# EAGLE board Banshee (EAGLE 9.6.2)
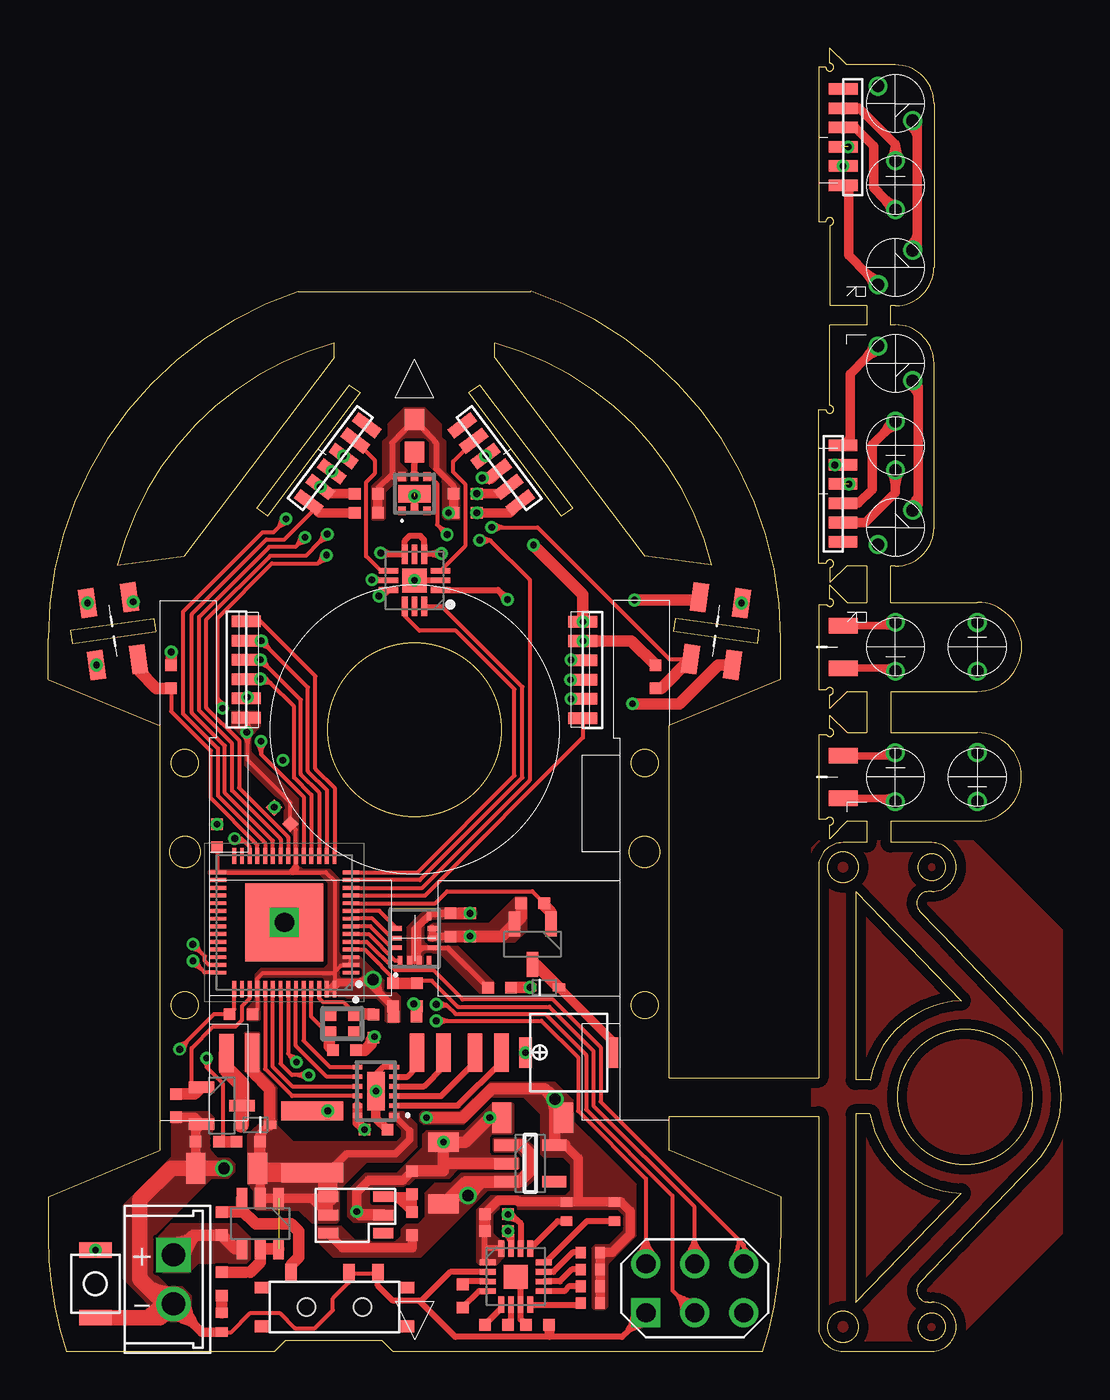
[diagram p2: board, top side]
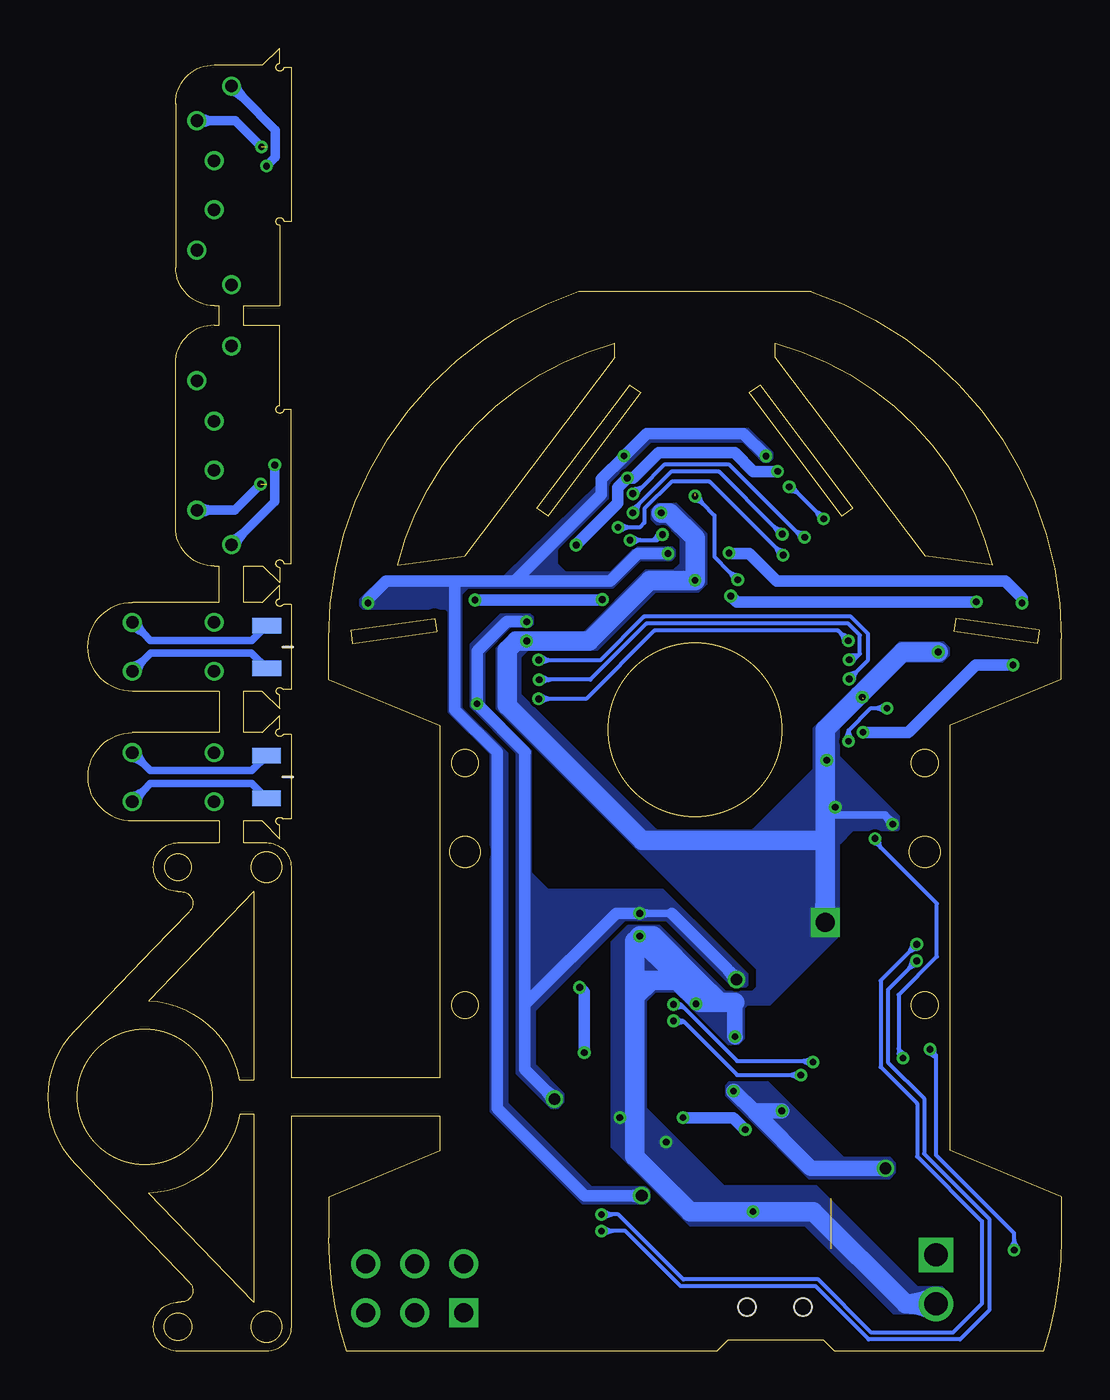
[diagram p3: board, bottom side, seen from below]

Size 52.55 x 67.62 mm. Coordinates in mm from the lower left corner, seen from the top.
Outline: 0.94,0 11.75,0 12.31,0.56 17.31,0.56 17.88,0 37.06,0 arc18 38,5.89
Outline: 0,36.98 0,34.85 5.79,32.46 5.79,10.44 0,8.03 0,5.89 arc18 0.94,0
Outline: 38,5.89 38,8.03 32.21,10.44 32.21,12.19 39.95,12.19 39.95,1.27 arc90 41.22,0 45.82,0 arc180 45.82,2.54 45.64,2.54
Outline: 25.02,54.99 12.98,54.99 arc71 0,36.98
Outline: 25.02,55 arc-72 38,36.98 38,34.85 32.21,32.46 32.21,14.2 39.95,14.2 39.95,25.12 arc-90 41.22,26.39 42.44,26.39 42.44,27.51 41.45,27.51 40.54,26.59 40.54,27.31 arc240 40.36,27.61
Outline: 23.17,52.31 arc-61 34.42,40.79 30.94,41.28 23.17,51.56 23.17,52.3
Outline: 51.16,9.73 47.09,5.54 45.21,3.56 arc133 45.64,2.56
Outline: 51.16,16.66 47.09,20.88 45.21,22.84
Outline: 42.62,14.07 41.89,14.07 41.89,23.85 47.35,18.19 arc78 42.63,14.07
Outline: 51.16,9.73 arc88 51.16,16.66
Outline: 47.35,8.2 41.89,2.54 41.89,12.32 42.62,12.32 arc78 47.35,8.2
Outline: 51.16,9.73 arc88 51.16,16.66
Outline: 45.22,22.84 arc-134 45.64,23.85 45.82,23.85 arc180 45.82,26.39 43.69,26.39 43.69,27.51 48.18,27.51 arc180 48.18,32.11 43.69,32.11 43.69,34.24 48.18,34.24 arc180 48.18,38.86 43.69,38.86 43.69,40.74 43.94,40.74 arc90 45.95,42.75 45.95,51.26 arc90 43.94,53.26
Outline: 40.54,39.04 40.54,39.05
Outline: 40.54,39.05 40.54,39.75 41.45,38.86 42.44,38.86 42.44,40.74 41.43,40.74 40.54,39.88 40.54,40.67 arc270 40.34,40.87 39.95,40.87 39.95,48.87 40.34,48.87 arc270 40.54,49.07 40.54,53.24 42.44,53.24 42.44,54.25 40.54,54.25 40.54,58.42 arc270 40.34,58.62 39.95,58.62 39.95,66.62 40.34,66.62 arc270 40.54,66.83 40.54,67.62 41.43,66.75 43.94,66.75 arc-90 45.95,64.75 45.95,56.24
Outline: 43.94,53.24 43.69,53.24 43.69,54.25 43.94,54.25 arc90 45.94,56.24
Outline: 3.59,40.79 arc-61 14.83,52.3 14.83,51.56 7.06,41.28 3.58,40.79
Outline: 40.54,39.05 arc-243 40.36,38.76 39.95,38.76 39.95,34.34 40.36,34.34
Outline: 40.37,34.34 arc-243 40.54,34.06 40.54,33.35 41.45,34.24 42.44,34.24 42.44,32.11 41.45,32.11 40.54,33 40.54,32.31
Outline: 40.54,32.31 40.54,32.31
Outline: 40.54,32.31 arc-240 40.36,32 39.95,32 39.95,27.61 40.36,27.61
Outline: 36.86,37.41 32.51,38.02 32.41,37.34 36.78,36.73 36.86,37.41
Outline: 1.14,37.41 5.49,38.02 5.59,37.34 1.25,36.73 1.14,37.41
Outline: 26.62,43.33 21.82,49.73 22.38,50.14 27.2,43.76 26.62,43.33
Outline: 11.38,43.33 16.18,49.73 15.62,50.14 10.82,43.76 11.38,43.33
Outline: circle at 7.09,17.96 radius 0.7
Outline: circle at 7.09,25.91 radius 0.8
Outline: circle at 7.09,30.53 radius 0.7
Outline: circle at 19,32.26 radius 4.5
Outline: circle at 30.94,17.96 radius 0.7
Outline: circle at 30.94,25.91 radius 0.8
Outline: circle at 30.94,30.53 radius 0.7
Outline: circle at 41.23,25.12 radius 0.8
Outline: circle at 41.23,1.27 radius 0.8
Outline: circle at 47.55,13.21 radius 3.5
Outline: circle at 45.82,1.27 radius 0.71
Outline: circle at 45.82,25.12 radius 0.7
Copper layers (1*16): Top 0.035mm / dielectric 1.6mm / Bottom 0.035mm
Design rules "Elecrow_2-layer_PCB_eagle_rule *": minimum track width 6mil, minimum drill 12mil, track to track 6mil, track to pad 6mil, pad to pad 6mil, via to via 8mil, smd to smd 0mil, copper to edge 20mil, drill to drill 10mil, minimum pad ring 6mil, minimum via ring 6mil, stop-mask expansion 0mil, vias tented up to drill 100mil, thermal gap 0mil

## Footprints (pad centres in the part's own frame; a part is rotated, then mirrored left to right if it is on the bottom)
C3216 = smd 1 x 1.6: 1 -1.6,0; 2 1.6,0
R1005 = smd 0.6 x 0.6: P$1 -0.6,0; P$2 0.6,0
HRCON-2 = drill 1.2 pad 1.778 square: 1 0,0 | drill 1.2 pad 1.778: 2 0,-2.54
SODFL1608X70N = smd 0.64 x 0.42: 1 -0.75,0; 2 0.75,0
QFN40P700X700X90-57N = smd 0.85 x 0.2: 1 -3.45,2.6; 2 -3.45,2.2; 3 -3.45,1.8; 4 -3.45,1.4; 5 -3.45,1; 6 -3.45,0.6; 7 -3.45,0.2; 8 -3.45,-0.2; 9 -3.45,-0.6; 10 -3.45,-1; 11 -3.45,-1.4; 12 -3.45,-1.8; 13 -3.45,-2.2; 14 -3.45,-2.6; 29 3.45,-2.6; 30 3.45,-2.2; 31 3.45,-1.8; 32 3.45,-1.4; 33 3.45,-1; 34 3.45,-0.6; 35 3.45,-0.2; 36 3.45,0.2; 37 3.45,0.6; 38 3.45,1; 39 3.45,1.4; 40 3.45,1.8; 41 3.45,2.2; 42 3.45,2.6 | smd 0.2 x 0.85: 15 -2.6,-3.45; 16 -2.2,-3.45; 17 -1.8,-3.45; 18 -1.4,-3.45; 19 -1,-3.45; 20 -0.6,-3.45; 21 -0.2,-3.45; 22 0.2,-3.45; 23 0.6,-3.45; 24 1,-3.45; 25 1.4,-3.45; 26 1.8,-3.45; 27 2.2,-3.45; 28 2.6,-3.45; 43 2.6,3.45; 44 2.2,3.45; 45 1.8,3.45; 46 1.4,3.45; 47 1,3.45; 48 0.6,3.45; 49 0.2,3.45; 50 -0.2,3.45; 51 -0.6,3.45; 52 -1,3.45; 53 -1.4,3.45; 54 -1.8,3.45; 55 -2.2,3.45; 56 -2.6,3.45 | smd 4.05 x 4.05: 57 0,0
QFN50P300X300X80-17N = smd 0.85 x 0.3: 1 -1.45,0.75; 2 -1.45,0.25; 3 -1.45,-0.25; 4 -1.45,-0.75; 9 1.45,-0.75; 10 1.45,-0.25; 11 1.45,0.25; 12 1.45,0.75 | smd 0.3 x 0.85: 5 -0.75,-1.45; 6 -0.25,-1.45; 7 0.25,-1.45; 8 0.75,-1.45; 13 0.75,1.45; 14 0.25,1.45; 15 -0.25,1.45; 16 -0.75,1.45 | smd 1.25 x 1.25: 17 0,0
LGA-14(2.5X3X0.86) = smd 0.475 x 0.25: 1 -1.163,0.75; 2 -1.163,0.25; 3 -1.163,-0.25; 4 -1.163,-0.75; 8 1.163,-0.75 | smd 0.25 x 0.475: 5 -0.5,-0.912; 6 0,-0.912; 7 0.5,-0.912; 12 0.5,0.912; 13 0,0.912; 14 -0.5,0.912
SOT95P275X110-5N = smd 1.25 x 0.6: 1 -1.25,0.95; 2 -1.25,0; 3 -1.25,-0.95; 4 1.25,-0.95; 5 1.25,0.95
QFN50P300X300X100-13N = smd 1 x 0.3: 1 -1.35,0.5; 2 -1.35,0; 3 -1.35,-0.5; 7 1.35,-0.5; 8 1.35,0; 9 1.35,0.5 | smd 0.3 x 1: 4 -0.5,-1.35; 5 0,-1.35; 6 0.5,-1.35; 10 0.5,1.35; 11 0,1.35; 12 -0.5,1.35 | smd 1.25 x 1.25: 13 0,0
BCR421UFD7 = smd 0.37 x 0.45: 1 -0.65,-0.886; 3 0.65,-0.886; 4 0.65,0.886; 5 0,0.886; 6 -0.65,0.886 | smd 0.37 x 0.6: 2 0,-0.75 | smd 1.67 x 0.9: 7 0,0
DRV8835DSSR = smd 0.5 x 0.25: 1 -0.95,1.25; 2 -0.95,0.75; 3 -0.95,0.25; 4 -0.95,-0.25; 5 -0.95,-0.75; 6 -0.95,-1.25; 7 0.95,-1.25; 8 0.95,-0.75; 9 0.95,-0.25; 10 0.95,0.25; 11 0.95,0.75; 12 0.95,1.25 | smd 0.9 x 2: 13 0,0
LTR4206E = drill 0.65 pad 0.9: 1 -1.27,0; 2 1.27,0
SOT95P284X110-6N = smd 1.1 x 0.55: 1 -1.3,0.95; 2 -1.3,0; 3 -1.3,-0.95; 4 1.3,-0.95; 5 1.3,0; 6 1.3,0.95
SOT95P237X112-3N = smd 1.3 x 0.6: 1 -1.05,0.95; 2 -1.05,-0.95; 3 1.05,0
R1005' = smd 0.6 x 0.6: P$1 -0.602,0; P$2 0.602,0
R1608 = smd 1.1 x 1: 1 -0.85,0; 2 0.85,0
SENSOR_FRONT_PAD2 = smd 0.8 x 1.5: P$1 -1.1,0.85; P$2 1.1,0.85
LED_1005 = smd 0.5 x 0.6: P$1 -0.5,0; P$2 0.5,0
MUN12AD01-SG = smd 1.05 x 0.55: P$1 0,0; P$2 0,-0.95; P$3 0,-1.9; P$4 2.85,-1.9; P$5 2.85,-0.95; P$6 2.85,0
SFH_4550 = drill 0.65: ANODE -1.27,0; CASODE 1.27,0
PIN2_3 = drill 1 square: P$1 0,0 | drill 1: P$2 2.54,0; P$3 5.08,0; P$4 0,2.54; P$5 2.54,2.54; P$6 5.08,2.54
ENCORDER_R = smd 0.6 x 1.5: P$1 -2.5,-1; P$2 -1.5,-1; P$3 -0.5,-1; P$4 0.5,-1; P$5 1.5,-1; P$6 2.5,-1
BUZZER = smd 0.635 x 1.6: + 4.25,2; - -0.25,2
PAD = smd 0.75 x 2: P$1 0,0
TVAF06 = smd 1.7 x 0.8: P$1 1.45,3.25; P$2 1.45,-0.25
SWITCH = smd 0.75 x 0.6: P$1 -0.4,0.3; P$2 -0.4,2.3; P$3 7.1,0.3; P$4 7.1,2.3 | smd 0.6 x 1: P$5 5.6,3.05; P$6 4.1,3.05; P$7 1.1,3.05 | hole 0.9: 1.9,1.3; 4.8,1.3
XRCGB32_F = smd 0.75 x 0.7: 1 -0.675,-0.5; 2 0.675,-0.5; 3 0.675,0.5; 4 -0.675,0.5

## Placement (x,y rotation side)
C1  [C3216]  25.13,12.13 0 top
C2  0.1u  [R1005]  20.88,22.13 270 top
C3  0.1u  [R1005]  18.5,17.38 0 top
C4  12pF  [R1005]  16.88,16.88 270 top
C5  0.1u  [R1005]  19.13,18.5 90 top
C6  12pF  [R1005]  15.38,15.63 0 top
C7  1u  [R1005]  21.5,2.88 270 top
C8  10uF  [C3216]  9.25,9.5 180 top
C9  100pF  [R1005]  18.88,6.63 90 top
C10  22uF  [C3216]  20.5,9.25 270 top
C11  1u  [R1005]  23.25,1.38 0 top
C12  100nF  [R1005]  21.88,22.13 270 top
C13  [C3216]  14.5,10.88 270 top
C14  22uF  [C3216]  12.88,10.88 90 top
C15  0.1u  [R1005]  17,11.5 0 top
C16  1u  [R1005]  25.38,1.38 0 top
C17  0.1u  [R1005]  12.14,27.79 315 top
C21  100nF  [R1005]  8.75,26.75 90 top
CN2  [HRCON-2]  6.5,5 0 top
D1  RB520S30T5G  [SODFL1608X70N]  25.74,18.88 0 top
D2  RB520S30T5G  [SODFL1608X70N]  10.75,11.75 180 top
IC1  ESP32-S3-WROOM-1-N8  [QFN40P700X700X90-57N]  12.25,22.25 180 top
IC2  MAX8647ETE+  [QFN50P300X300X80-17N]  24.25,3.88 0 top
IC3  LSM6DS3USTR  [LGA-14(2.5X3X0.86)]  19,21.44 90 top
IC5  NCV8163ASN330T1G  [SOT95P275X110-5N]  25,9.75 0 top
IC6  DG2034EDN-T1-GE4  [QFN50P300X300X100-13N]  19,40 180 top
IC7  BCR421UFD-7  [BCR421UFD7]  19,44.5 0 top
IC8  DRV8835DSSR  [DRV8835DSSR]  17,13.5 180 top
Q1  LTR-4206E  [LTR4206E]  43.94,29.79 90 top
Q2  SI3493DDV-T1-GE3  [SOT95P284X110-6N]  11,6.63 270 top
Q3  IRFML8244TRPBF  [SOT95P237X112-3N]  25.13,21.13 270 top
Q4  LTR-4206E  [LTR4206E]  43.94,64.75 225 bottom
Q5  LTR-4206E  [LTR4206E]  43.94,56.24 45 top
Q6  LTR-4206E  [LTR4206E]  43.94,51.26 315 top
Q7  LTR-4206E  [LTR4206E]  43.94,36.56 270 top
Q8  LTR-4206E  [LTR4206E]  43.94,42.75 45 top
Q10  IRFML8244TRPBF  [SOT95P237X112-3N]  9,12.75 0 top
R1  10k  [R1005']  17.88,18.5 90 top
R2  3k  [R1005']  10.38,10.88 180 top
R3  1k  [R1005']  8.25,10.88 180 top
R4  100k  [R1005']  9,3.5 270 top
R5  50  [R1005']  23.4,18.87 180 top
R7  10k  [R1005']  9,6.63 270 top
R8  10k  [R1005']  10,17.5 180 top
R9  10k  [R1005']  25.13,23.25 180 top
R10  10k  [R1005']  6.63,12.75 270 top
R12  100k  [R1005']  23.25,6.25 0 top
R13  100k  [R1005']  23.25,7.13 180 top
R15  1k  [R1005']  21.63,44.5 0 top
R16  1k  [R1005']  21.63,43.5 0 top
R17  1k  [R1005']  16.5,43.5 180 top
R18  1k  [R1005']  6.38,35 270 top
R19  18  [R1608]  19,47.5 270 top
R21  1k  [R1005']  16.5,44.5 180 top
R22  1k  [R1005']  31.5,35 270 top
R25  13~20k  [R1005']  18.88,8.75 270 top
U$1  SENSOR_FRONT_PAD2  [SENSOR_FRONT_PAD2]  40.38,29.8 270 top
U$2  LED_1005  [LED_1005]  9,1.5 270 top
U$3  MUN12AD01-SG  [MUN12AD01-SG]  17.38,6.13 180 top
U$4  SFH4550  [SFH_4550]  48.19,36.55 90 top
U$5  SENSOR_FRONT_PAD2  [SENSOR_FRONT_PAD2]  34.52,36.61 172 top
U$6  PIN2_3  [PIN2_3]  31,2 0 top
U$7  SENSOR_FRONT_PAD2  [SENSOR_FRONT_PAD2]  3.48,36.6 188 top
U$8  SENSOR_FRONT_PAD2  [SENSOR_FRONT_PAD2]  3.25,38.14 8 top
U$9  SENSOR_FRONT_PAD2  [SENSOR_FRONT_PAD2]  40.38,29.8 90 bottom
U$10  ENCORDER_1  [ENCORDER_R]  40.22,44.5 90 top
U$11  SENSOR_FRONT_PAD2  [SENSOR_FRONT_PAD2]  40.38,36.55 270 top
U$12  ENCORDER_1  [ENCORDER_R]  42.23,63 270 top
U$13  BUZZER_44  [BUZZER]  29,17.5 180 top
U$14  SFH4550  [SFH_4550]  43.95,60.5 90 bottom
U$15  ENCORDER_1  [ENCORDER_R]  9.27,35.38 90 top
U$16  SFH4550  [SFH_4550]  43.94,46.99 270 top
U$17  SENSOR_FRONT_PAD2  [SENSOR_FRONT_PAD2]  40.38,36.55 90 bottom
U$18  PAD  [PAD]  10.58,15.49 0 top
U$19  LED_1005  [LED_1005]  28.13,4.25 180 top
U$20  SENSOR_FRONT_PAD2  [SENSOR_FRONT_PAD2]  34.76,38.13 352 top
U$21  LED_1005  [LED_1005]  28.13,5.13 180 top
U$22  ENCORDER_1  [ENCORDER_R]  14.22,46.66 53 top
U$23  LED_1005  [LED_1005]  29.38,7.25 270 top
U$24  ENCORDER_1  [ENCORDER_R]  23.78,46.65 307 top
U$25  LED_1005  [LED_1005]  28.13,3.38 180 top
U$26  PAD  [PAD]  22.13,15.5 0 top
U$27  PAD  [PAD]  20.5,15.5 0 top
U$28  ENCORDER_1  [ENCORDER_R]  28.74,35.35 270 top
U$29  PAD  [PAD]  23.5,15.5 0 top
U$30  LED_1005  [LED_1005]  26.88,7.25 270 top
U$31  LED_1005  [LED_1005]  28.13,2.5 180 top
U$43  TVAF06  [TVAF06]  1,2 0 top
U$44  SFH4550  [SFH_4550]  48.19,29.8 270 top
U$53  SWICH  [SWITCH]  11.5,1 0 top
U$57  PAD  [PAD]  19.13,15.5 0 top
U$58  PAD  [PAD]  9.24,15.47 0 top
Y1  XRCGB40M000F5A00R0  [XRCGB32_F]  15.25,17 180 top

## Tracks (layer width: path | path; a pad name or v marks a point on that pad's centre or on a via)
+3V3  (via drill 0.35 pad 0.65, 0.6 pad 0.9)
  Top 0.2: IC3.2 19,20.28 IC3.3 19.25,20.72 | IC3.5 19.47,20.94 19.25,20.72 | 19.57,22.42 19.25,22.1 19.25,20.72 | 10.35,32.67 10.35,32.8 U$15.P$1 | 10.35,32.67 10.35,32.13 | 10.35,32.13 10.35,31.56 | IC1.55 14.63,18.8 IC1.56 | IC1.3 IC1.2 15.65,20 15.17,20 14.85,19.68 | v16.85,19.29 16.82,19.29 16.66,19.13 16.1,19.13 | 16.1,19.13 15.18,19.13 IC1.56 | 14.85,19.68 14.85,19.63 | 14.85,19.63 IC1.56 | R8.P$1 10.85,17.75 IC1.46 10.85,19.35 11.13,19.63 14.85,19.63 | 12.73,24.85 IC1.29 8.8,26.1 C21.P$1 | 12.73,24.85 12.85,24.98 12.85,25.08 IC1.20 12.85,27.07 C17.P$2 12.56,28.47 10.35,30.68 10.35,31.56 | 12.73,24.85 14.4,24.85 14.85,24.4 14.85,19.68 | 16.05,12.41 IC8.12 | 10.35,32.13 10.31,32.13 v10.29,32.12 | 10.35,31.56 10.35,31.57 v10.29,32.12 | 16.1,19.13 arc-29 16.76,18.95 v16.85,19.29 | 16.1,19.13 arc29 16.63,19.56 v16.85,19.29 | 10.35,32.67 arc-29 10.1,32.23 v10.29,32.12 | 10.35,32.67 arc29 10.51,32.19 v10.29,32.12 | 10.35,31.56 arc-29 10.51,32.05 | 10.35,31.56 arc29 10.1,32 | 10.35,31.56 arc-29 10.51,32.05 | v10.29,32.12 10.51,32.05 | 10.35,31.56 arc29 10.1,32 | v10.29,32.12 10.1,32 | R13.P$2
  Top 0.25: IC3.5 19.06,20.94 19,21 | IC3.5 19.97,20.94 | IC3.5 20.74,20.94 R5.P$2
  Top 0.3: IC2.1 22.65,4.78 22.65,5.34 | 22.65,5.34 R12.P$1 | IC2.16 23.48,5.34 22.65,5.34
  Top 0.4: C2.P$1 19.87,22.73 IC3.8 19.57,22.42 19.53,22.42 19,21.89 19,21 19,20.28 | R1.P$1 17.18,18.59 | 17.18,18.59 16.63,19.15 16.09,19.15 | 14.63,18.8 14.98,19.15 16.09,19.15 | 12.68,24.9 12.85,25.08 | 16.05,11.93 16.05,12.41 16.05,12.72 IC8.11 | 17.18,18.59 arc-29 17.1,19.31 v16.85,19.29 | 17.18,18.59 arc29 16.67,19.11 v16.85,19.29 | 16.09,19.15 arc-29 16.81,19.04 v16.85,19.29 | 16.09,19.15 arc29 16.73,19.51 v16.85,19.29 | 16.05,11.93 arc-29 16.29,11.45 C15.P$1 16.48,11.6 arc-29 16.05,11.93
  Top 0.5: C15.P$1 16.05,11.85 | 16.05,11.93 IC8.12 | 27.5,7.75 U$30.P$1 24.4,7.75 24.32,7.83 23.35,7.83 R13.P$2 | 27.5,7.75 U$23.P$1 29.7,7.75 30.2,7.26 30.2,6.08 29.24,5.13 U$21.P$1 U$19.P$1 U$25.P$1 U$31.P$1 | 27.5,7.75 27.5,10 26.8,10.7
  Top 0.508: 16.05,11.85 16.05,11.93 16.05,12.72
  Top 0.6: U$28.P$1 v27.74,37.86 27.74,39.27 v25.17,41.83 | v30.31,33.59 32.74,33.59 34.76,35.61 U$5.P$1 | C2.P$1 C12.P$1 | R1.P$1 17.9,17.87 C3.P$1 | v22.51,45.31 22.95,45.31 U$24.P$4 | v19.63,12.12 21.5,12.12 23,13.63 25.74,13.63 | v26.29,13.09 25.75,13.63 25.74,13.63 | 26.29,12.32 26.29,10.74 IC5.5 26.8,10.7 | 26.29,12.32 v26.29,13.09 | R12.P$1 R13.P$2 | 25.74,13.63 arc-29 26.16,13 v26.29,13.09 | 25.74,13.63 arc29 26.37,13.21 v26.29,13.09 | 26.29,12.32 arc-29 26.43,13.06 v26.29,13.09 | 26.29,12.32 arc29 26.14,13.06 v26.29,13.09
  Bottom 0.4: C12.P$1 21.32,22.73 | 21.32,22.73 20.21,22.73 | 21.32,22.73 arc-29 21.85,22.6 C12.P$1 | 21.32,22.73 arc29 21.85,22.85 C12.P$1
  Bottom 0.6: v27.74,37.86 28.77,37.86 30.31,36.33 v30.31,33.59 v30.31,33.58 27.8,31.08 27.82,31.06 27.82,18 | 20.21,22.73 17.35,19.87 | 17.35,19.87 17.31,19.83 17.15,19.58 v16.85,19.29 | C15.P$1 17.02,12.12 v19.63,12.12 | v10.29,32.12 7.94,32.12 4.45,35.61 U$7.P$2 | U$22.P$3 15.97,45.65 16.94,46.62 20.88,46.62 22.19,45.31 v22.51,45.31 v22.52,45.31 23.01,44.82 23.01,44.02 25.17,41.86 v25.17,41.83 | 27.82,18 23.09,22.73 C12.P$1 | v26.29,13.09 26.83,13.63 | 26.83,13.63 27.82,14.62 27.82,18 | 17.35,19.87 arc-29 16.76,19.41 v16.85,19.29 | 17.35,19.87 arc29 16.98,19.21 v16.85,19.29 | 26.83,13.63 arc-29 26.2,13.21 v26.29,13.09 | 26.83,13.63 arc29 26.41,13 v26.29,13.09
  other vias: 16.4,11.5 14.72,45.65 2.51,35.61 21.88,22.73
  pour Top: 23.66,5.75 23.66,4.9 23.23,4.47 22.37,4.47 22.22,4.62 22.22,7.34 22.99,8.11 26.86,8.11 27.1,8.35 27.1,9.67 26.71,10.06 25.71,10.06 25.54,10.23 25.54,12.29 24.66,13.17 22.95,13.17 21.53,11.74 19.47,11.74 19.28,11.93 19.28,12.31 19.45,12.49 21.39,12.49 22.87,13.97 26.27,13.97 27.26,12.98 27.26,11.91 30.48,8.69 30.48,5.98 29.02,4.52 29.02,2.3 28.86,2.14 28.33,2.14 28.22,2.26 28.22,5.37 28.41,5.56 29.14,5.56 29.86,6.29 29.86,7.05 29.56,7.35 24.37,7.35 24.21,7.5 23.49,7.5 23.07,7.07 23.07,6.13 23.42,5.78 23.63,5.78
  pour Bottom: 16.27,18.98 16.37,18.88 17.05,18.88 20.48,22.32 22.65,22.32 27.3,17.67 27.3,14.88 25.8,13.38 25.8,12.91 26.13,12.59 26.47,12.59 28.28,14.4 28.28,31.03 30.67,33.42 30.67,36.71 29.09,38.29 27.57,38.29 27.4,38.12 27.4,37.72 27.57,37.55 28.58,37.55 29.91,36.22 29.91,33.58 27.5,31.17 27.5,24.85 26.64,23.99 20.67,23.99 16.27,19.59
  pour Top: 10.31,17.27 10.31,17.85 10.73,18.27 10.73,19.57 11.05,19.89 14.32,19.89 14.54,20.11 14.54,24.29 14.11,24.71 8.38,24.71 8.34,24.76 8.34,24.95 8.39,25.01 12.57,25.01 12.78,25.22 12.78,25.42 12.93,25.42 12.93,25.27 13.18,25.02 14.6,25.02 15.07,24.54 15.07,20.69 15.21,20.55 16.12,20.55 18.25,18.43 18.25,17.08 18.2,17.03 17.58,17.03 17.49,17.12 17.49,17.86 17.05,18.3 14.35,18.3 14.29,18.37 14.29,19.23 14.11,19.4 11.13,19.4 11.04,19.31 11.04,17.26 10.93,17.15 10.35,17.15 10.31,17.19 10.31,17.28
  pour Top: 13.06,25.13 13.06,28.57 10.53,31.11 10.53,31.93 11.04,32.44 11.04,33.15 10.98,33.21 9.53,33.21 9.49,33.17 9.49,32.35 10.06,31.78 10.06,30.54 12.22,28.38 12.22,27.27 12.6,26.89 12.6,25.07 13.01,25.07
  pour Top: 18.63,20.04 18.63,22.02 19.66,23.04 22.15,23.04 22.21,22.99 22.21,22.45 22.16,22.4 19.81,22.4 19.47,22.07 19.47,21.3 19.72,21.05 21.24,21.05 23.15,19.14 23.15,18.6 23.11,18.56 22.41,18.56 20.32,20.65 19.61,20.65 19.51,20.56 19.51,20.12 19.38,19.99 18.68,19.99
+5V  (via drill 0.35 pad 0.65, 0.6 pad 0.9)
  Top 0.3: v20.4,41.39 v20.39,41.38 19.85,41.38 | 19.85,41.38 19.53,41.38 IC6.4 19.5,42.1 19.3,42.3 18.74,42.3 18.5,42.07 IC6.6 17.8,41.35 | 17.8,41.35 17.32,41.35 v17.24,41.42 | 19.85,41.38 arc-29 20.35,41.23 v20.4,41.39 | 19.85,41.38 arc29 20.34,41.56 v20.4,41.39 | 17.8,41.35 arc-29 17.32,41.58 v17.24,41.42 | 17.8,41.35 arc29 17.28,41.25 v17.24,41.42
  Top 0.5: U$3.P$6 15.28,5.38 18.88,5.38 C9.P$1
  Top 0.6: U$24.P$3 v22.68,46.46 | C10.2 21,8.15 | 21,8.15 21.65,8.8 22.01,8.8 | 22.01,8.8 IC5.3 24.43,8.8 | IC5.1 24.55,10.7 25,10.25 25,9.38 24.43,8.8 | 24.43,8.8 24.39,8.77 22.46,8.77 22.31,8.62 | v21.77,8.07 22.31,8.62 | 21,8.15 arc-29 21.72,7.93 v21.77,8.07 | 21,8.15 arc29 21.75,8.22 v21.77,8.07 | 22.01,8.8 arc-29 21.64,8.15 v21.77,8.07 | 22.01,8.8 arc29 21.92,8.05 v21.77,8.07 | 22.31,8.62 arc-29 21.68,8.2 v21.77,8.07 | 22.31,8.62 arc29 21.89,7.99 v21.77,8.07
  Bottom 0.6: v20.4,41.39 21.97,41.39 23.41,39.95 28.35,39.95 | 28.35,39.95 31.46,39.95 | 31.46,39.95 35.03,39.95 35.97,39.02 U$20.P$2 | 31.46,39.95 31.46,33.28 29.26,31.09 29.26,12.61 24.72,8.06 22.54,8.06 | v17.24,41.42 17.22,41.4 16.2,41.4 14.76,39.96 2.91,39.96 2.04,39.08 U$8.P$1 | 28.35,39.95 28.35,39.98 23.87,44.45 23.87,45.25 22.68,46.44 v22.68,46.46 v22.67,46.46 21.5,47.63 16.49,47.63 U$22.P$4 | v21.77,8.07 v21.77,8.06 22.54,8.06 | 22.54,8.06 arc-29 21.8,8.22 v21.77,8.07 | 22.54,8.06 arc29 21.8,7.92 v21.77,8.07
  other vias: 15.32,46.45 35.97,38.82 2.04,38.83
  pour Top: 13.87,6.39 13.87,5.77 14.76,4.89 19.35,4.89 22.81,8.35 24.62,8.35 25.36,9.08 25.36,10.44 24.75,11.05 23.12,11.05 23.05,10.99 23.05,10.44 23.14,10.36 24.34,10.36 24.6,10.1 24.6,9.39 24.44,9.23 21.41,9.23 20.89,8.7 20.04,8.7 19.53,8.2 19.53,6.94 19.19,6.6 18.57,6.6 18.29,6.32 18.29,5.94 18.11,5.77 15.93,5.77 15.2,6.49 13.97,6.49
  pour Bottom: 21.36,7.84 21.58,7.62 24.82,7.62 29.63,12.42 29.63,30.98 31.79,33.15 31.79,38.37 31.92,38.5 36.21,38.5 36.39,38.68 36.39,39.02 35.19,40.23 28.92,40.23 21.5,47.5 21.5,47.75 21.34,47.91 16.23,47.91 14.97,46.66 14.97,46.33 15.19,46.11 15.46,46.11 16.5,47.15 21.33,47.15 23.41,45.07 23.41,44.34 26.14,41.61 26.14,40.89 25.73,40.47 23.36,40.47 22.08,41.75 20.19,41.75 20.03,41.59 20.03,41.23 20.24,41.01 21.85,41.01 23.28,39.58 30.78,39.58 31.09,39.26 31.09,33.41 28.72,31.04 28.72,12.89 24.4,8.56 21.59,8.56 21.34,8.32 21.34,7.85
A_CW_CCW
  Top 0.2: IC1.47 11.25,14.65 12.65,13.25 IC8.10
A_PWM
  Top 0.2: IC1.48 11.65,14.75 12.65,13.75 IC8.9
B_CW_CCW
  Top 0.2: IC1.51 12.85,15.86 14.46,14.25 IC8.8
B_PWM
  Top 0.2: IC1.52 13.25,16.11 14.61,14.75 IC8.7
BATTERY  (via drill 0.35 pad 0.65)
  Top 0.2: v8.22,15.21 8.22,14.74 8.3,14.66 | 8.3,14.66 9.05,13.91 9.05,11.07 R3.P$1 | IC1.26 10.45,26.18 10.2,26.43 | 10.2,26.43 10.03,26.61 v9.67,26.61 | 8.3,14.66 arc-29 8.44,15.15 v8.22,15.21 | 8.3,14.66 arc29 8.02,15.09 v8.22,15.21 | 10.2,26.43 arc-29 9.82,26.77 v9.67,26.61 | 10.2,26.43 arc29 9.7,26.38 v9.67,26.61
  Top 0.6: R2.P$2 R3.P$1
  Bottom 0.2: 8.45,15.72 8.45,18.5 6.46,20.48 6.46,23.23 9.37,26.14 | 8.45,15.72 8.45,15.44 v8.22,15.21 | 9.37,26.14 9.67,26.44 v9.67,26.61 | 8.45,15.72 arc-29 8.07,15.38 v8.22,15.21 | 8.45,15.72 arc29 8.44,15.21 v8.22,15.21 | 9.37,26.14 arc-29 9.8,26.42 v9.67,26.61 | 9.37,26.14 arc29 9.45,26.64 v9.67,26.61
BUZZER
  Top 0.2: IC1.10 20.07,23.25 20.69,23.87 25.11,23.87 R9.P$1 25.73,23.13
  Top 0.6: Q3.1 26.08,22.79 25.74,23.13 25.73,23.13
EN
  Top 0.2: IC1.4 16.42,20.85 18.17,19.1 | C5.P$2 19.25,19.23 19.9,19.23 21.25,17.88 25.99,17.88 28.28,15.58 28.28,12.75 33.5,7.53 33.5,5.81 | R1.P$2 18.17,19.1 | 18.17,19.1 18.25,19.1 | 33.5,5.81 33.5,4.58 U$6.P$5 | 33.5,5.81 arc-29 32.97,4.85 U$6.P$5 | 33.5,5.81 arc29 34.09,4.89 U$6.P$5
  Top 0.6: C5.P$2 18.25,19.1
EN_CLK
  Top 0.2: IC3.13 17.82,21.44 16.81,22.45 IC1.8
EN_GN_SSL
  Top 0.2: IC1.9 17.18,22.85 IC3.12
EN_MISO
  Top 0.2: IC3.1 17.99,20.28 16.61,21.65 IC1.6
EN_MOSI
  Top 0.2: IC3.14 17.82,20.94 16.71,22.05 IC1.7
ENC_L_A  (via drill 0.35 pad 0.65)
  Top 0.2: IC1.17 14.05,28.98 13.1,29.93 13.1,33.8 11.41,35.49 | v27.09,34.85 27.64,34.85 | 27.64,34.85 U$28.P$4 | v11.01,35.88 11.41,35.49 | U$15.P$4 10.45,35.88 | 10.45,35.88 v11.01,35.88 | 27.64,34.85 arc-29 27.18,35.06 v27.09,34.85 | 27.64,34.85 arc29 27.18,34.64 v27.09,34.85 | 11.41,35.49 arc-29 11.22,35.97 v11.01,35.88 | 11.41,35.49 arc29 10.93,35.67 v11.01,35.88 | 10.45,35.88 arc-29 10.92,35.68 v11.01,35.88 | 10.45,35.88 arc29 10.92,36.09 v11.01,35.88
  Bottom 0.2: 26.53,34.85 24.43,34.85 21.53,37.75 11.05,37.75 10.46,37.16 10.46,36.19 10.51,36.14 | 26.53,34.85 v27.09,34.85 | v11.01,35.88 10.76,35.88 10.51,36.14 | 26.53,34.85 arc-29 26.99,34.64 v27.09,34.85 | 26.53,34.85 arc29 26.99,35.06 v27.09,34.85 | 10.51,36.14 arc-29 10.83,35.74 v11.01,35.88 | 10.51,36.14 arc29 11.02,36.11 v11.01,35.88
ENC_L_B  (via drill 0.35 pad 0.65)
  Top 0.2: IC1.18 13.65,28.87 12.75,29.77 12.75,33.45 11.52,34.68 | v27.11,35.87 27.67,35.87 | 27.67,35.87 27.72,35.87 U$28.P$3 v27.11,35.87 | v11.01,34.89 11.32,34.89 11.52,34.68 | U$15.P$3 10.45,34.89 | 10.45,34.89 v11.01,34.89 | 27.67,35.87 arc-29 27.21,36.08 v27.11,35.87 | 27.67,35.87 arc29 27.21,35.67 v27.11,35.87 | v27.11,35.87 27.21,36.08 arc29 27.67,35.86 arc29 27.2,35.66 v27.11,35.87 | 11.52,34.68 arc-29 11.17,35.04 v11.01,34.89 | 11.52,34.68 arc29 11.02,34.66 v11.01,34.89 | 10.45,34.89 arc-29 10.91,34.68 v11.01,34.89 | 10.45,34.89 arc29 10.91,35.09 v11.01,34.89
  Bottom 0.2: 26.56,35.85 23.93,35.85 21.66,38.12 10.92,38.12 10.02,37.22 10.02,35.87 10.61,35.28 | 26.56,35.85 27.09,35.85 v27.11,35.87 | v11.01,34.89 10.61,35.28 | 26.56,35.85 arc-29 27.03,35.66 v27.11,35.87 | 26.56,35.85 arc29 27.01,36.08 v27.11,35.87 | 10.61,35.28 arc-29 10.79,34.8 v11.01,34.89 | 10.61,35.28 arc29 11.09,35.1 v11.01,34.89
ENC_L_CLK  (via drill 0.35 pad 0.65)
  Top 0.2: IC1.16 14.45,29.12 13.47,30.1 13.47,34.45 11.45,36.47 | v27.11,33.85 27.67,33.85 | 27.67,33.85 U$28.P$5 | U$28.P$5 | 11.45,36.47 v11.05,36.87 | U$15.P$5 10.5,36.88 | 10.5,36.88 v11.04,36.88 v11.05,36.87 | U$28.P$5 27.67,33.85 | 27.67,33.85 v27.11,33.85 | 27.67,33.85 arc-29 27.21,34.06 | v27.11,33.85 27.21,34.06 | 27.67,33.85 arc29 27.21,33.64 v27.11,33.85 | 27.67,33.85 arc-29 27.21,34.06 | v27.11,33.85 27.21,34.06 | 27.67,33.85 arc29 27.21,33.65 v27.11,33.85 | 11.45,36.47 arc-29 11.26,36.95 v11.05,36.87 | 11.45,36.47 arc29 10.97,36.66 v11.05,36.87 | 10.5,36.88 arc-29 10.95,36.66 v11.05,36.87 | 10.5,36.88 arc29 10.96,37.08 v11.05,36.87
  Bottom 0.2: 26.56,33.85 24.65,33.85 21.11,37.39 11.58,37.39 11.45,37.26 | 26.56,33.85 v27.11,33.85 | v11.05,36.87 11.45,37.26 | 26.56,33.85 arc-29 27.02,33.64 v27.11,33.85 | 26.56,33.85 arc29 27.02,34.06 v27.11,33.85 | 11.45,37.26 arc-29 10.97,37.08 v11.05,36.87 | 11.45,37.26 arc29 11.26,36.79 v11.05,36.87
ENC_L_CS
  Top 0.2: U$15.P$6 11.01,37.88 13.85,35.04 13.85,30.23 14.85,29.23 IC1.15
ENC_R_CS
  Top 0.2: IC1.11 19.54,23.65 27.74,31.84 U$28.P$6
GMF
  pour Top: 40.01,26.52 47.96,26.52 48.36,26.11 52.6,21.87 52.6,7.98 52.6,6.1 46.48,-0.02 40.51,-0.02 39.96,0.53 39.6,0.89 39.6,3.58 39.6,26.11
GND  (via drill 0.35 pad 0.65, 0.6 pad 0.9, 1 pad 1.5)  (1 unrouted)
  Top 0.2: IC3.6 19.91,21.5 19.91,21.63 IC3.7 | 24.52,22.52 Q3.2 24.06,22.06 | C17.P$1 v11.73,28.23 | U$2.P$2 9.51,1 10.49,1.99 12,1.99 12.79,1.2 13.83,1.2 14.76,2.13 14.76,2.74 15.6,3.57 U$53.P$6 U$53.P$5
  Top 0.3: IC6.2 19.56,40 | 19.56,40 IC6.13 | 17.84,45.5 17.84,47.13 R19.1 20.12,47.13 20.12,45.8 21.02,44.89 R15.P$1 | 17.84,45.5 17.84,45.41 17.86,45.39 IC7.6 | 20.5,21.53 20.01,21.53 19.91,21.63 | 16.23,15.63 16.53,15.93 | 16.53,15.93 16.75,16.15 | C4.P$2 v16.93,16.33 | IC8.6 17.38,14.75 17,14.38 17,14.24 | R21.P$1 17.1,44.76 17.84,45.5 | U$6.P$1 30.1,1.1 | 30.1,1.1 29.75,0.75 26,0.75 | 26,0.75 21.13,0.75 19.25,2.63 | U$53.P$5 17.1,3.4 17.88,2.63 19.25,2.63 | 26,0.96 26,0.75 | IC2.2 20.86,4.13 19.36,2.63 19.25,2.63 | 19.56,40 arc-29 19.06,40.17 IC6.13 | 19.56,40 arc29 19.06,39.83 IC6.13 | 16.53,15.93 arc-29 17,16.17 v16.93,16.33 | 16.53,15.93 arc29 16.77,16.4 v16.93,16.33 | 30.1,1.1 arc-29 31.18,1.43 U$6.P$1 | 30.1,1.1 arc29 30.43,2.18 U$6.P$1
  Top 0.4: C2.P$2 20.5,21.53 19.94,21.53 19.91,21.5 | IC3.6 IC3.7
  Top 0.5: U$2.P$2 7.96,1 7.58,1.38 | 7.58,1.38 CN2.2 | R10.P$2 7.6,12.15 Q10.2 7.65,11.5 R3.P$2 C8.2 | R17.P$1 R21.P$1 | R15.P$1 21.02,43.77 | 21.02,43.77 R16.P$1 v20.76,43.5 21.02,43.77 | R25.P$1 18.4,8.88 16.63,8.88 16,8.25 v16,7.25 | C15.P$2 17,12.1 IC8.13 17,14.24 | 7.58,1.38 arc-29 7.11,2.68 CN2.2 | 7.58,1.38 arc29 6.28,1.85 CN2.2
  Top 0.508: C16.P$2 26,1.35 26,0.96
  Top 0.6: U$3.P$2 16.18,7.08 v16,7.25 | R22.P$1 30.25,36.85 U$28.P$2 | C2.P$2 C12.P$2 | R9.P$2 24.52,22.52 24.06,22.06 23.53,21.53 C12.P$2 | C3.P$2 19.1,17.88 C5.P$1 19.08,17.9 v18.96,18.03 | C6.P$2 16.23,15.63 16.42,15.63 16.75,15.96 16.75,16.15 C4.P$2 | C12.P$2 v21.88,21.55 | R18.P$1 v6.38,36.27 v6.38,36.28 | IC5.2 20.5,9.75 | R25.P$1 18.9,9.38 20.5,9.38 20.5,9.75 | 20.5,9.75 C10.1 21.63,10.85 v22.9,12.13 C1.1
  Top 0.8: v9.11,9.5 C8.2 6.38,9.5 4.75,7.88 4.75,3.75 5.21,3.29 | CN2.2 6.04,2.46 5.21,3.29 | U$43.P$2 5.15,1.75 | 5.15,1.75 5.79,1.75 CN2.2 | 5.21,3.29 arc-29 6.11,2.15 CN2.2 | 5.21,3.29 arc29 6.62,2.95 CN2.2 | 5.15,1.75 arc-29 6.58,1.97 CN2.2 | 5.15,1.75 arc29 6.14,2.8 CN2.2
  Top 1: C14.2 C13.1
  Bottom 0.2: v11.73,28.23 11.9,28.4 12.25,28.4
  Bottom 0.4: C21.P$2 9.1,27.78 | 9.1,27.78 9.14,27.82 12.25,27.82 | 9.1,27.78 arc-29 8.67,27.45 C21.P$2 | 9.1,27.78 arc29 8.86,27.29 C21.P$2
  Bottom 0.6: 21,19.25 22.13,18.13 22.13,19.38 | v18.96,18.03 18.89,18.1 | 18.89,18.1 18.77,18.1 | 18.89,18.1 18.89,19.24 18.88,19.25 | v10.33,33.93 10.42,34.03 10.48,34.03
  Bottom 0.8: 15.94,12.44 13,9.5 v9.11,9.5 | C13.1 15.9,12.48 15.94,12.44 | 15.94,12.44 IC8.13 | 16.95,18.1 16.95,16.35 v16.93,16.33
  Bottom 1: CN2.2 8.03,2.46 | 8.03,2.46 8.09,2.46 12.88,7.25 v16,7.25 19.25,7.25 22.13,10.13 22.13,19.38 | 22.13,19.38 22.13,21.3 21.94,21.48 v21.88,21.55 | IC1.57 12.25,23.53 | 12.25,23.53 12.25,26.5 | 12.25,26.5 12.25,27.82 12.25,28.4 12.25,32.26 10.48,34.03 8.22,36.28 v6.38,36.28 | 16.95,18.1 17.72,18.1 18.88,19.25 19.93,19.25 | 20.09,19.25 21,19.25 22,19.25 22.13,19.38 | 12.25,26.5 21.75,26.5 28.75,33.5 28.75,36.38 28.27,36.85 U$28.P$2 24.49,36.85 21.34,40 IC6.13 19,40.56 19,42.2 20.31,43.5 v20.76,43.5 | 12.25,23.53 arc-29 12.01,22.3 IC1.57 | 12.25,23.53 arc29 12.5,22.3 IC1.57 | 8.03,2.46 arc-29 6.61,2.85 CN2.2 | 8.03,2.46 arc29 6.61,2.07 CN2.2
  Bottom 1.016: 17.72,18.1 18.77,18.1 19.93,19.25 20.09,19.25 | 20.09,19.25 22,19.25 | 18.88,19.25 21.17,21.55 v21.88,21.55 | 21.94,21.48 20.09,19.63 20.09,19.25
  other vias: 19,40 27.74,36.85 12.25,22.25 17,13.5 14.5,12.48 20.5,10.85 8.75,27.35 12.17,30.67
  pour Bottom: 5.99,2.07 6.15,1.91 8.7,1.91 13.28,6.49 19.25,6.49 23.34,10.58 23.34,21.25 22.48,22.11 20.85,22.11 17.44,18.7 16.01,18.7 15.81,18.9 15.81,19.81 29.31,33.32 29.31,36.5 28.45,37.36 24.76,37.36 21.56,40.55 20.1,40.55 19.77,40.88 19.77,42.14 20.5,42.88 21,42.88 21.28,43.16 21.28,43.69 20.94,44.03 19.98,44.03 18.4,42.44 18.4,39.81 18.83,39.38 21.08,39.38 24.09,36.37 27.67,36.37 28.05,35.99 28.05,34.1 21.01,27.07 16,27.07 12.86,30.21 12.86,32.34 8.38,36.82 6.13,36.82 5.82,36.51 5.82,36.1 6.17,35.75 8.11,35.75 11.53,32.32 11.53,21.56 15.13,17.96 16.3,17.96 16.46,17.8 16.46,16.22 16.77,15.91 17.28,15.91 19.99,18.62 21.07,18.62 21.53,18.16 21.53,12.63 17.52,8.62 12.72,8.62 7.48,3.38 6.21,3.38 5.99,3.16 5.99,2.07
  pour Top: 6.51,12.46 8.27,12.46 8.62,12.12 8.62,11.5 8.43,11.31 8.43,10.39 8.78,10.04 9.36,10.04 9.67,9.73 9.67,9.31 9.32,8.95 8.45,8.95 5.5,6 5.5,4.08 6.21,3.37 6.93,3.37 7.41,2.89 7.41,2.11 6.84,1.54 6.1,1.54 3.88,3.76 3.88,7.56 6.4,10.09 6.4,12.35
  pour Top: 17.95,6.82 17.79,6.66 15.86,6.66 15.53,6.98 15.53,8.33 16.47,9.27 18.12,9.27 19.42,10.57 19.42,11.26 19.63,11.47 21.63,11.47 23.08,12.92 24.05,12.92 24.14,12.83 24.14,11.34 24.06,11.26 23.01,11.26 22.87,11.11 22.87,10.3 22.99,10.18 24.26,10.18 24.42,10.02 24.42,9.49 24.34,9.41 21.23,9.41 20.77,8.96 19.02,8.96 18.59,8.52 16.83,8.52 16.66,8.34 16.66,7.7 16.76,7.6 17.83,7.6 17.95,7.48 17.95,6.82
  pour Bottom: 8.89,10.06 11.29,10.06 15.21,13.97 17.25,13.97 17.44,13.78 17.44,13.28 13.11,8.95 8.91,8.95 8.58,9.28 8.58,9.75
  pour Top: 16.84,43.1 16.74,43.21 16.74,44.83 17.35,45.44 17.35,47.22 17.63,47.5 17.63,48.13 18.49,49 19.51,49 20.4,48.11 20.4,47.45 20.63,47.22 20.63,45.62 21.41,44.83 21.41,43.23 21.31,43.13 20.6,43.13 20.45,43.28 20.45,45.26 19.79,45.92 19.79,47.14 19.58,47.35 18.42,47.35 18.21,47.14 18.21,46.13 18.59,45.75 18.59,45.19 18.52,45.11 18.01,45.11 17.48,44.58 17.48,43.21 17.37,43.1
  pour Bottom: 8.41,27.07 8.49,26.99 10.81,26.99 11.47,26.34 11.83,26.34 12.24,26.74 12.24,30.93 11.56,30.93 8.4,27.77 8.4,27.08 8.41,27.08
  pour Top: 19.65,21.38 19.8,21.23 24.24,21.23 24.85,21.85 24.85,23.52 24.79,23.58 24.23,23.58 22.85,22.21 19.88,22.21 19.65,21.99
GPIO0
  Top 0.2: IC1.5 16.52,21.25 17.99,19.78 19.97,19.78 21.5,18.25 26.18,18.25 28.65,15.78 28.65,12.95 36.08,5.52 U$6.P$6 | U$6.P$6 35.46,4.75 arc29 35.82,5.79 arc29 36.56,4.98 U$6.P$6
L45_CATHODE
  Top 0.2: IC6.7 17.24,40.5 16.49,41.25 16.49,45.09 16.94,45.53 16.94,46.24 U$22.P$5
L90_CATHODE  (via drill 0.35 pad 0.65)
  Top 0.2: U$8.P$2 4.41,38.94 v4.41,38.89 U$8.P$2
  Top 0.3: 17.63,39.48 IC6.9 v17.15,39.19 | 17.63,39.48 17.34,39.19 v17.15,39.19 | 17.63,39.48 arc-29 17.11,39.36 v17.15,39.19 | 17.63,39.48 arc29 17.29,39.07 v17.15,39.19 | v17.15,39.19 17.11,39.36 arc29 17.62,39.48 arc29 17.29,39.07 v17.15,39.19
  Bottom 0.6: v4.41,38.89 16.85,38.89 v17.15,39.19
LED_A0
  Top 0.2: IC1.13 19.28,24.45 24.59,29.76 24.59,34.48 20.42,38.65 IC6.12
LED_A1
  Top 0.2: IC1.14 19.16,24.85 24.18,29.87 24.18,34.35 21.15,37.39 19.25,37.39 18.5,38.14 IC6.10
LED_EN  (via drill 0.35 pad 0.65)
  Top 0.2: v20.69,42.38 20.3,42.78 | 20.3,42.78 20.18,42.9 20.18,45.03 19.76,45.45 IC7.4 | v22.38,42.09 22.92,42.09 22.94,42.07 | 22.94,42.07 24.98,40.03 24.98,29.62 19.4,24.05 IC1.12 | 22.94,42.07 arc-29 22.48,42.29 v22.38,42.09 | 22.94,42.07 arc29 22.47,41.88 v22.38,42.09 | 20.3,42.78 arc-29 20.48,42.3 v20.69,42.38 | 20.3,42.78 arc29 20.77,42.59 v20.69,42.38
  Bottom 0.2: v22.38,42.09 21.82,42.09 | 21.82,42.09 21.17,42.09 | 21.17,42.09 20.99,42.09 v20.69,42.38 | 21.82,42.09 arc-29 22.29,41.88 v22.38,42.09 | 21.82,42.09 arc29 22.29,42.3 v22.38,42.09 | 21.17,42.09 arc-29 20.88,42.51 v20.69,42.38 | 21.17,42.09 arc29 20.66,42.16 v20.69,42.38
LED_SCL  (via drill 0.35 pad 0.65)
  Top 0.2: IC1.42 8.12,19.65 7.9,19.86 | 7.9,19.86 v7.51,20.26 | v23.85,6.24 R12.P$2 | 7.9,19.86 arc-29 7.72,20.34 v7.51,20.26 | 7.9,19.86 arc29 7.43,20.05 v7.51,20.26
  Top 0.3: R12.P$2 24.01,6.09 24.01,5.71 | 24.01,5.71 IC2.15 | 24.01,5.71 arc-29 24.03,6.23 v23.85,6.24 23.71,6.14 arc-29 24.01,5.71
  Bottom 0.2: v7.51,20.26 7.9,19.86 | 7.9,19.86 9,18.77 9,15 7.13,13.13 7.13,10.25 3.75,6.88 3.75,2.13 5.25,0.62 10,0.62 12.75,3.38 19.75,3.38 22.62,6.24 23.3,6.24 | 23.3,6.24 v23.85,6.24 | 7.9,19.86 arc-29 7.72,20.34 v7.51,20.26 | 7.9,19.86 arc29 7.43,20.05 v7.51,20.26 | 23.3,6.24 arc-29 23.76,6.03 v23.85,6.24 | 23.3,6.24 arc29 23.76,6.45 v23.85,6.24
LED_SDA  (via drill 0.35 pad 0.65)
  Top 0.2: IC1.41 8.32,20.05 8.12,20.25 8.12,20.49 7.89,20.72 | 7.89,20.72 v7.5,21.12 | v23.85,7.1 R13.P$1 | 7.89,20.72 arc-29 7.71,21.2 v7.5,21.12 | 7.89,20.72 arc29 7.42,20.9 v7.5,21.12
  Top 0.3: R13.P$1 24,7.13 24.33,6.8 | 24.33,6.8 24.5,6.63 IC2.14 | 24.33,6.8 arc-29 23.99,7.21 v23.85,7.1 23.81,6.93 arc-29 24.33,6.8
  Bottom 0.2: v7.5,21.12 7.89,20.72 | 7.89,20.72 9.38,19.24 9.38,14.75 7.48,12.85 7.48,10.1 4.13,6.75 4.13,2.47 5.63,0.97 9.85,0.97 12.6,3.73 19.6,3.73 22.97,7.1 23.3,7.1 | 23.3,7.1 v23.85,7.1 | 7.89,20.72 arc-29 7.71,21.2 v7.5,21.12 | 7.89,20.72 arc29 7.42,20.9 v7.5,21.12 | 23.3,7.1 arc-29 23.76,6.89 v23.85,7.1 | 23.3,7.1 arc29 23.76,7.31 v23.85,7.1
N$1  (via drill 0.35 pad 0.65)
  Top 0.6: R5.P$1 24.01,18.88 D1.1
  Bottom 0.6: U$13.+ 24.75,18.65 D1.1
  other vias: 24.75,15.5 24.99,18.88
N$2  (via drill 0.35 pad 0.65)  (1 unrouted)
  Top 0.2: v19,44.38 19,43.82 | 19,43.82 IC7.2 | IC6.8 17.34,40 | 17.34,40 16.82,40 v16.79,40.04 | 17.34,40 arc-29 16.89,40.24 v16.79,40.04 | 17.34,40 arc29 16.86,39.82 v16.79,40.04 | 19,43.82 arc-29 19.21,44.28 v19,44.38 | 19,43.82 arc29 18.79,44.28 v19,44.38
  Bottom 0.2: v16.79,40.04 16.81,40.04 17.19,40.42 | 18.61,43.98 18,43.38 18,41.23 17.19,40.42 | 18.61,43.98 v19,44.38 | 17.19,40.42 arc-29 16.71,40.25 v16.79,40.04 | 17.19,40.42 arc29 17,39.95 v16.79,40.04 | 18.61,43.98 arc-29 19.08,44.16 v19,44.38 | 18.61,43.98 arc29 18.79,44.46 v19,44.38
N$3
  Top 0.2: 26.54,18.83 D1.2 | D1.2 | Q3.3 25.29,20.08 D1.2
  Top 0.5: U$13.- 29.25,16.11 26.54,18.83
  Top 0.6: D1.2 25.3,20.08 Q3.3
N$4
  Top 0.6: U$2.P$1 R4.P$2
N$7
  Top 0.4: Q1.2 43.78,30.9 43.13,30.9 | 43.13,30.9 U$1.P$1 | 43.13,30.9 arc-29 43.9,30.78 Q1.2 | 43.13,30.9 arc29 43.79,31.31 Q1.2
N$8
  Top 0.4: Q1.1 43.76,28.7 43.13,28.7 | 43.13,28.7 U$1.P$2 | 43.13,28.7 arc-29 43.79,28.28 Q1.1 | 43.13,28.7 arc29 43.9,28.81 Q1.1
N$9
  Bottom 0.4: U$44.ANODE 47.61,30.48 | 47.61,30.48 47.25,30.13 42,30.13 U$9.P$2 | 47.61,30.48 arc-29 48.31,30.81 U$44.ANODE | 47.61,30.48 arc29 47.93,31.19 U$44.ANODE
N$10
  Bottom 0.4: U$44.CASODE 47.61,29.11 | 47.61,29.11 47.26,29.46 41.99,29.46 U$9.P$1 | 47.61,29.11 arc-29 47.93,28.41 U$44.CASODE | 47.61,29.11 arc29 48.31,28.79 U$44.CASODE
N$12
  Top 0.3: IC8.3 20.38,13.25 22.13,15 U$26.P$1
N$13
  Top 0.3: IC8.4 19.5,13.75 20.5,14.75 U$27.P$1
N$14
  Top 0.5: Q5.1 42.46,55.92 | 42.46,55.92 41.52,56.87 41.52,60.21 U$12.P$6 | 42.46,55.92 arc-29 42.84,55.23 Q5.1 | 42.46,55.92 arc29 43.16,55.55 Q5.1
N$15
  Top 0.6: 10.05,7.33 10.76,6.62 12.6,6.62 12.98,6.23 12.98,4.88 12.6,4.49 U$53.P$7 | R7.P$1 9.95,7.23 10.05,7.33 | Q2.3 10.05,7.33
N$16  (via drill 0.35 pad 0.65)
  Bottom 0.5: Q4.1 42.46,65.06 | 42.46,65.06 40.76,63.37 40.76,61.96 U$12.P$5 | 42.46,65.06 arc-29 43.16,65.44 Q4.1 | 42.46,65.06 arc29 42.84,65.76 Q4.1
  other vias: 41.23,61.5
N$17
  Top 0.6: CN2.1 7.52,6.02 7.64,6.02 | 7.64,6.02 R7.P$2 9.7,5.33 Q2.4 | 7.64,6.02 arc-29 6.31,5.57 CN2.1 | 7.64,6.02 arc29 7.04,4.75 CN2.1
  pour Top: 5.7,4.35 5.94,4.11 7.31,4.11 7.77,4.57 10.27,4.57 10.5,4.81 10.5,5.89 9.78,6.61 6.37,6.61 5.7,5.94
N$18  (via drill 0.35 pad 0.65)  (1 unrouted)
  Top 0.5: Q5.2 45.06,57.36 45.06,57.93 | 45.06,63.05 45.06,63.63 Q4.2 | 45.06,63.05 45.06,57.93 | 45.06,57.93 arc-29 44.64,57.26 Q5.2 | 45.06,57.93 arc29 45.08,57.14 Q5.2 | 45.06,63.05 arc-29 45.08,63.85 Q4.2 | 45.06,63.05 arc29 44.64,63.73 Q4.2
  Bottom 0.5: v41.49,62.5 42.85,63.85 44.01,63.85 | 44.01,63.85 Q4.2 | 44.01,63.85 arc-29 44.77,63.62 Q4.2 | 44.01,63.85 arc29 44.77,64.08 Q4.2
N$19
  Top 0.8: D2.2 10,12.7 Q10.3 10.05,13.85 9.24,14.66 U$58.P$1
N$20
  Top 0.5: U$10.P$2 42.39,43 43.94,44.56 43.94,44.89 | 43.94,44.89 U$16.CASODE | 43.94,44.89 arc-29 44.17,45.65 U$16.CASODE | 43.94,44.89 arc29 43.71,45.65 U$16.CASODE
N$21
  Top 0.5: U$14.ANODE 43.36,59.82 | 43.36,59.82 42.81,60.37 42.81,62.53 41.85,63.5 U$12.P$3 | 43.36,59.82 arc-29 43.74,59.12 U$14.ANODE | 43.36,59.82 arc29 44.06,59.44 U$14.ANODE
N$24
  Top 0.5: Q6.1 42.46,51.57 | 42.46,51.57 41.6,50.71 41.6,47.37 U$10.P$6 | 42.46,51.57 arc-29 43.16,51.95 Q6.1 | 42.46,51.57 arc29 42.83,52.27 Q6.1
N$25
  Top 0.35: R19.2 18.98,45.47 IC7.5
N$26
  Bottom 0.4: U$4.ANODE 47.6,35.87 | 47.6,35.87 47.23,36.24 42.02,36.24 U$17.P$1 | 47.6,35.87 arc-29 47.93,35.16 U$4.ANODE | 47.6,35.87 arc29 48.31,35.54 U$4.ANODE
N$27  (via drill 0.35 pad 0.65)
  Top 0.5: v40.8,45.99 40.81,46 U$10.P$5 v40.8,45.99
  Bottom 0.5: Q8.1 42.46,42.44 | 42.46,42.44 40.8,44.09 v40.8,45.99 | 42.46,42.44 arc-29 42.83,41.74 Q8.1 | 42.46,42.44 arc29 43.16,42.06 Q8.1
N$28
  Top 0.5: 18.08,8.03 U$3.P$3 18.75,8.02 R25.P$2 C9.P$2 18.08,8.03
N$29
  Bottom 0.4: U$4.CASODE 47.6,37.23 | 47.6,37.23 47.26,36.89 41.98,36.89 U$17.P$2 | 47.6,37.23 arc-29 48.31,37.56 U$4.CASODE | 47.6,37.23 arc29 47.93,37.94 U$4.CASODE
N$30
  Top 0.3: IC8.2 21.25,12.75 23.5,15 U$29.P$1
N$31
  Top 0.4: Q7.1 43.77,37.65 43.13,37.65 | 43.13,37.65 U$11.P$1 | 43.13,37.65 arc-29 43.9,37.54 Q7.1 | 43.13,37.65 arc29 43.79,38.07 Q7.1
N$32
  Top 0.2: IC1.54 14.05,18.32 14.25,18.12 15.3,18.12 Y1.1
  Top 0.6: Y1.1 16.85,17.5 C4.P$1
N$33
  Top 0.2: Y1.3 14.49,16.5 13.65,17.34 IC1.53
  Top 0.6: C6.P$1 14.58,15.83 Y1.3
N$34
  Top 0.4: Q7.2 43.78,35.45 43.13,35.45 | 43.13,35.45 U$11.P$2 | 43.13,35.45 arc-29 43.79,35.04 Q7.2 | 43.13,35.45 arc29 43.9,35.57 Q7.2
N$36  (via drill 0.35 pad 0.65)  (1 unrouted)
  Top 0.5: 45.14,49.59 45.14,50.06 Q6.2 | 45.14,49.59 45.14,44.42 | 45.14,44.42 45.14,43.95 Q8.2 | 45.14,49.59 arc-29 45.08,50.38 Q6.2 | 45.14,49.59 arc29 44.65,50.22 Q6.2 | 45.14,44.42 arc-29 44.65,43.79 Q8.2 | 45.14,44.42 arc29 45.08,43.63 Q8.2
  Bottom 0.5: Q8.2 44.01,43.65 | 44.01,43.65 42.88,43.65 v41.53,45 | 44.01,43.65 arc-29 44.77,43.42 Q8.2 | 44.01,43.65 arc29 44.77,43.88 Q8.2
N$37
  Top 0.5: U$14.CASODE 43.95,62.6 | 43.95,62.6 43.95,62.63 42.08,64.5 U$12.P$2 | 43.95,62.6 arc-29 43.72,61.84 U$14.CASODE | 43.95,62.6 arc29 44.17,61.84 U$14.CASODE
N$38
  Top 0.5: U$10.P$3 42.01,44 42.73,44.72 42.73,47.05 43.36,47.67 | 43.36,47.67 U$16.ANODE | 43.36,47.67 arc-29 44.06,48.05 U$16.ANODE | 43.36,47.67 arc29 43.73,48.37 U$16.ANODE
N$45
  Top 0.25: 21.65,3.63 C7.P$1
  Top 0.3: IC2.3 21.65,3.63
N$46
  Top 0.3: C7.P$2 22.35,3.13 IC2.4
N$47
  Top 0.2: 23.5,2.23 IC2.5
  Top 0.3: C11.P$1 23.5,2.23
N$48
  Top 0.2: 23.93,1.45 C11.P$2
  Top 0.3: IC2.6 24,1.53 23.93,1.45
N$49
  Top 0.2: 24.5,3.63 IC2.17
  Top 0.3: C16.P$1 24.5,1.65 IC2.7 24.5,3.63
N$50
  Top 0.3: IC2.8 27.55,2.43 U$31.P$2
N$51
  Top 0.3: IC2.13 26.43,6.75 U$30.P$2
N$54
  Top 0.3: U$23.P$2 27.94,6.75 25.82,4.63 IC2.12
N$55
  Top 0.3: U$21.P$2 27.2,5.13 26.2,4.13 IC2.11
N$56
  Top 0.3: U$19.P$2 27.16,4.25 26.54,3.63 IC2.10
N$57
  Top 0.3: U$25.P$2 27.04,3.38 26.79,3.13 IC2.9
N$61
  Top 0.3: IC8.5 18.63,14.25 19.13,14.75 U$57.P$1
R45_CATHODE
  Top 0.2: IC6.3 21.63,41.78 21.63,45 21,45.63 21,46.17 U$24.P$2
R90_CATHODE  (via drill 0.35 pad 0.65)
  Top 0.3: IC6.1 23.32,39.5 23.42,39.4 | v23.82,39.01 23.42,39.4 | 23.42,39.4 arc-29 23.66,38.93 v23.82,39.01 | 23.42,39.4 arc29 23.9,39.16 v23.82,39.01
  Top 0.6: v30.41,38.98 33.64,38.98 U$20.P$1
  Bottom 0.6: v30.41,38.98 23.84,38.98 v23.82,39.01
RXD  (via drill 0.35 pad 0.65)
  Top 0.2: 12.49,15.4 12.45,15.44 IC1.50 | 12.49,15.4 v12.88,15.01 | v20.13,18 20.63,18 20.68,17.95 | 20.68,17.95 21.13,17.5 25.79,17.5 27.91,15.38 27.91,12.55 32.38,8.08 32.38,3.17 32.64,2.9 | 32.64,2.9 U$6.P$2 | 12.49,15.4 arc-29 12.67,14.92 v12.88,15.01 | 12.49,15.4 arc29 12.96,15.22 v12.88,15.01 | 20.68,17.95 arc-29 20.24,18.2 v20.13,18 | 20.68,17.95 arc29 20.2,17.79 v20.13,18 | 32.64,2.9 arc-29 32.91,1.84 U$6.P$2 | 32.64,2.9 arc29 33.7,2.63 U$6.P$2
  Bottom 0.2: 19.59,17.84 16.81,15.06 13.44,15.06 | 19.59,17.84 19.75,18 v20.13,18 | 13.44,15.06 12.94,15.06 v12.88,15.01 | 13.44,15.06 arc-29 12.95,15.22 v12.88,15.01 | 13.44,15.06 arc29 13,14.81 v12.88,15.01 | 19.59,17.84 arc-29 20.1,17.78 v20.13,18 | 19.59,17.84 arc29 19.98,18.17 v20.13,18
SEN_L45
  Top 0.2: IC1.23 11.65,26.48 9.16,28.97 9.16,31.41 7.45,33.13 7.45,38.25 11.32,42.13 12.25,42.13 13.85,43.72
  Top 0.5: U$22.P$1 13.85,43.72 14.07,43.5 R17.P$2
SEN_L45_2  (via drill 0.35 pad 0.65)
  Top 0.2: 11.96,42.77 11.69,42.5 11.12,42.5 7,38.38 7,33.08 8.8,31.28 8.8,28.84 11.25,26.38 IC1.24 | 11.96,42.77 12.33,43.14 v12.33,43.19 | 11.96,42.77 arc-29 12.43,42.98 v12.33,43.19 | 11.96,42.77 arc29 12.12,43.26 v12.33,43.19
  Top 0.5: R21.P$2 14.47,44.5 U$22.P$2
  Bottom 0.2: v12.33,43.19 12.73,43.58 | 12.73,43.58 13.67,44.52 | 13.67,44.52 14,44.86 U$22.P$2 | 12.73,43.58 arc-29 12.25,43.4 v12.33,43.19 | 12.73,43.58 arc29 12.54,43.11 v12.33,43.19 | 13.67,44.52 arc-29 14.16,44.63 U$22.P$2 | 13.67,44.52 arc29 13.92,44.97 U$22.P$2
  other vias: 14.12,44.86
SEN_L90
  Top 0.2: IC1.25 10.85,26.28 8.43,28.7 8.43,31.15 6.38,33.21 R18.P$2
  Top 0.6: R18.P$2 5.62,34.4 4.69,35.33 U$7.P$1
SEN_R45  (via drill 0.35 pad 0.65)
  Top 0.2: 14.08,42.01 13.35,41.27 11.51,41.27 8.21,37.97 8.21,33.39 9.9,31.7 9.9,29.24 12.45,26.68 IC1.21 | 14.08,42.01 v14.48,42.4 | 14.08,42.01 arc-29 14.56,42.19 v14.48,42.4 | 14.08,42.01 arc29 14.27,42.48 v14.48,42.4
  Top 0.5: R16.P$2 23.93,43.5 U$24.P$6
  Bottom 0.2: v14.48,42.4 14.6,42.52 14.65,42.52 14.89,42.77 | 14.89,42.77 17.76,45.63 20.25,45.63 21.9,43.98 21.88,43.99 21.91,43.96 | 21.91,43.96 22.23,43.65 R16.P$2 | 14.89,42.77 arc-29 14.41,42.62 v14.48,42.4 | 14.89,42.77 arc29 14.69,42.31 v14.48,42.4 | 21.91,43.96 arc-29 22,43.46 R16.P$2 | 21.91,43.96 arc29 22.35,43.69 R16.P$2
  other vias: 22.23,43.5
SEN_R45_2  (via drill 0.35 pad 0.65)
  Top 0.2: v13.32,42.23 12.92,41.84 | 12.92,41.84 12.82,41.73 11.45,41.73 7.83,38.11 7.83,33.25 9.54,31.53 9.54,29.09 12.05,26.58 IC1.22 | 12.92,41.84 arc-29 13.4,42.02 v13.32,42.23 | 12.92,41.84 arc29 13.1,42.32 v13.32,42.23
  Top 0.5: R15.P$2 23.53,44.5 U$24.P$5
  Bottom 0.2: 13.77,42.55 17.23,46 20.61,46 21.78,44.83 | 13.77,42.55 13.46,42.23 v13.32,42.23 | R15.P$2 22.11,44.5 21.78,44.83 | 13.77,42.55 arc-29 13.27,42.46 v13.32,42.23 | 13.77,42.55 arc29 13.51,42.12 v13.32,42.23 | 21.78,44.83 arc-29 22.03,44.39 R15.P$2 | 21.78,44.83 arc29 22.27,44.72 R15.P$2
  other vias: 22.23,44.5
SEN_R90  (via drill 0.35 pad 0.65)
  Top 0.2: v11.04,31.65 11.04,31.09 | 11.04,31.09 11.04,30.98 13.25,28.77 IC1.19 | 14.04,40.92 14,40.88 11.61,40.88 8.79,38.06 8.79,33.87 | 14.04,40.92 v14.43,41.31 | v23,42.75 23.56,42.75 | 23.56,42.75 25.39,42.75 32.22,35.92 U$5.P$2 | v9.04,33.37 8.79,33.63 8.79,33.87 | 11.04,31.09 arc-29 11.25,31.56 v11.04,31.65 | 11.04,31.09 arc29 10.83,31.56 v11.04,31.65 | 14.04,40.92 arc-29 14.51,41.1 v14.43,41.31 | 14.04,40.92 arc29 14.22,41.39 v14.43,41.31 | 23.56,42.75 arc-29 23.09,42.96 v23,42.75 | 23.56,42.75 arc29 23.09,42.54 v23,42.75 | 8.79,33.87 arc-29 8.81,33.36 v9.04,33.37 | 8.79,33.87 arc29 9.18,33.55 v9.04,33.37
  Top 0.6: R22.P$2 31.79,34.4 U$5.P$2
  Bottom 0.2: v11.04,31.65 11.04,32.21 9.88,33.37 9.6,33.37 | 22.44,42.75 21.88,42.75 21.63,43 21.63,43.72 20.22,45.13 18.24,45.13 14.82,41.71 | 22.44,42.75 v23,42.75 | v14.43,41.31 14.82,41.71 | 9.6,33.37 v9.04,33.37 | v11.04,31.65 10.83,31.74 arc29 11.04,32.21 arc29 11.25,31.74 v11.04,31.65 | 14.82,41.71 arc-29 14.35,41.52 v14.43,41.31 | 14.82,41.71 arc29 14.64,41.23 v14.43,41.31 | 22.44,42.75 arc-29 22.91,42.54 v23,42.75 | 22.44,42.75 arc29 22.91,42.96 v23,42.75 | 9.6,33.37 arc-29 9.13,33.58 v9.04,33.37 | 9.6,33.37 arc29 9.13,33.16 v9.04,33.37
SUCTION_PWM
  Top 0.2: IC1.45 10.45,18.31 10.05,17.91 10.05,17.18 9.72,16.85 8.55,16.85 7.43,15.73 7.43,13.98 7.71,13.7 Q10.1
  Top 0.6: R10.P$1 7.6,13.35 Q10.1
SW1  (via drill 0.35 pad 0.65)
  Top 0.2: 7.2,16.08 8.62,17.5 R8.P$2 9.65,17.75 IC1.43 | 7.2,16.08 6.82,15.69 v6.82,15.67 | 7.2,16.08 arc-29 6.73,15.88 v6.82,15.67 | 7.2,16.08 arc29 7.03,15.6 v6.82,15.67
  Bottom 0.2: U$43.P$1 2.45,5.81 | 2.45,5.81 2.45,6.13 6.5,10.18 6.5,15.21 | 6.5,15.21 6.5,15.35 v6.82,15.67 | 2.45,5.81 arc-29 2.24,5.34 U$43.P$1 | 2.45,5.81 arc29 2.66,5.34 U$43.P$1 | 6.5,15.21 arc-29 6.94,15.48 v6.82,15.67 | 6.5,15.21 arc29 6.59,15.71 v6.82,15.67
  other vias: 2.45,5.25
TXD  (via drill 0.35 pad 0.65)
  Top 0.2: IC1.49 12.05,14.92 12.64,14.33 12.96,14.33 | v13.51,14.33 12.96,14.33 | v20.13,17.14 v20.13,17.15 20.68,17.15 | 20.68,17.15 25.58,17.15 27.48,15.25 27.48,12.47 31,8.96 31,5.82 | 31,5.82 U$6.P$4 | 12.96,14.33 arc-29 13.42,14.13 v13.51,14.33 | 12.96,14.33 arc29 13.42,14.54 v13.51,14.33 | 20.68,17.15 arc-29 20.22,17.35 v20.13,17.14 | 20.68,17.15 arc29 20.22,16.94 v20.13,17.14 | 31,5.82 arc-29 30.44,4.87 U$6.P$4 | 31,5.82 arc29 31.56,4.87 U$6.P$4
  Bottom 0.2: 19.57,17.09 19.63,17.14 v20.13,17.14 | 19.57,17.09 16.82,14.33 14.07,14.33 | 14.07,14.33 v13.51,14.33 | 14.07,14.33 arc-29 13.61,14.54 v13.51,14.33 | 14.07,14.33 arc29 13.61,14.13 v13.51,14.33 | 19.57,17.09 arc-29 20.05,16.93 v20.13,17.14 | 19.57,17.09 arc29 20.01,17.34 v20.13,17.14
VCC  (1 unrouted)
  Top 0.2: C8.1 11.14,9.7 | U$3.P$4 14.53,7.75
  Top 0.3: IC8.1 18.75,11.45
  Top 0.4: C13.2 15.48,10.25 18,10.25 18.75,11 18.75,11.45
  Top 0.5: 10.22,4.1 10.48,4.1 | C8.1 11,9.35 Q2.2 Q2.1 13.68,7.93 | D2.1 10.98,11.23 R2.P$1 | 14.53,7.75 U$3.P$5 13.68,7.93 | 13.68,7.93 14.43,7.93 U$3.P$4
  Top 0.6: D2.1 11.5,13.6 10.58,14.52 U$18.P$1 | C8.1 10.98,9.63 R2.P$1 | Q2.6 Q2.5 11,4.63 10.48,4.1 | R4.P$1 10.22,4.1
  Top 1: 11,9.35 11.08,9.28 C14.1 C13.2 14.5,8.05 U$3.P$4
  pour Top: 10.32,11.19 10.32,8.67 10.64,8.35 10.64,7.5 10.81,7.33 13.01,7.33 13.67,6.67 14.98,6.67 15.13,6.82 15.13,8.41 16.55,9.83 18.35,9.83 19.13,10.61 19.13,11.74 18.43,12.44 17.77,12.44 17.67,12.34 17.67,12.15 18.31,11.51 18.31,11.1 18.08,10.86 12.71,10.86 11.88,11.69 11.88,13.68 10.99,14.58 10.99,16.49 10.94,16.54 10.21,16.54 10.18,16.51 10.18,14.52 11.17,13.53 11.17,12.04